# EAGLE schematic Circuit-board-eagle-sheme (EAGLE 6.4)
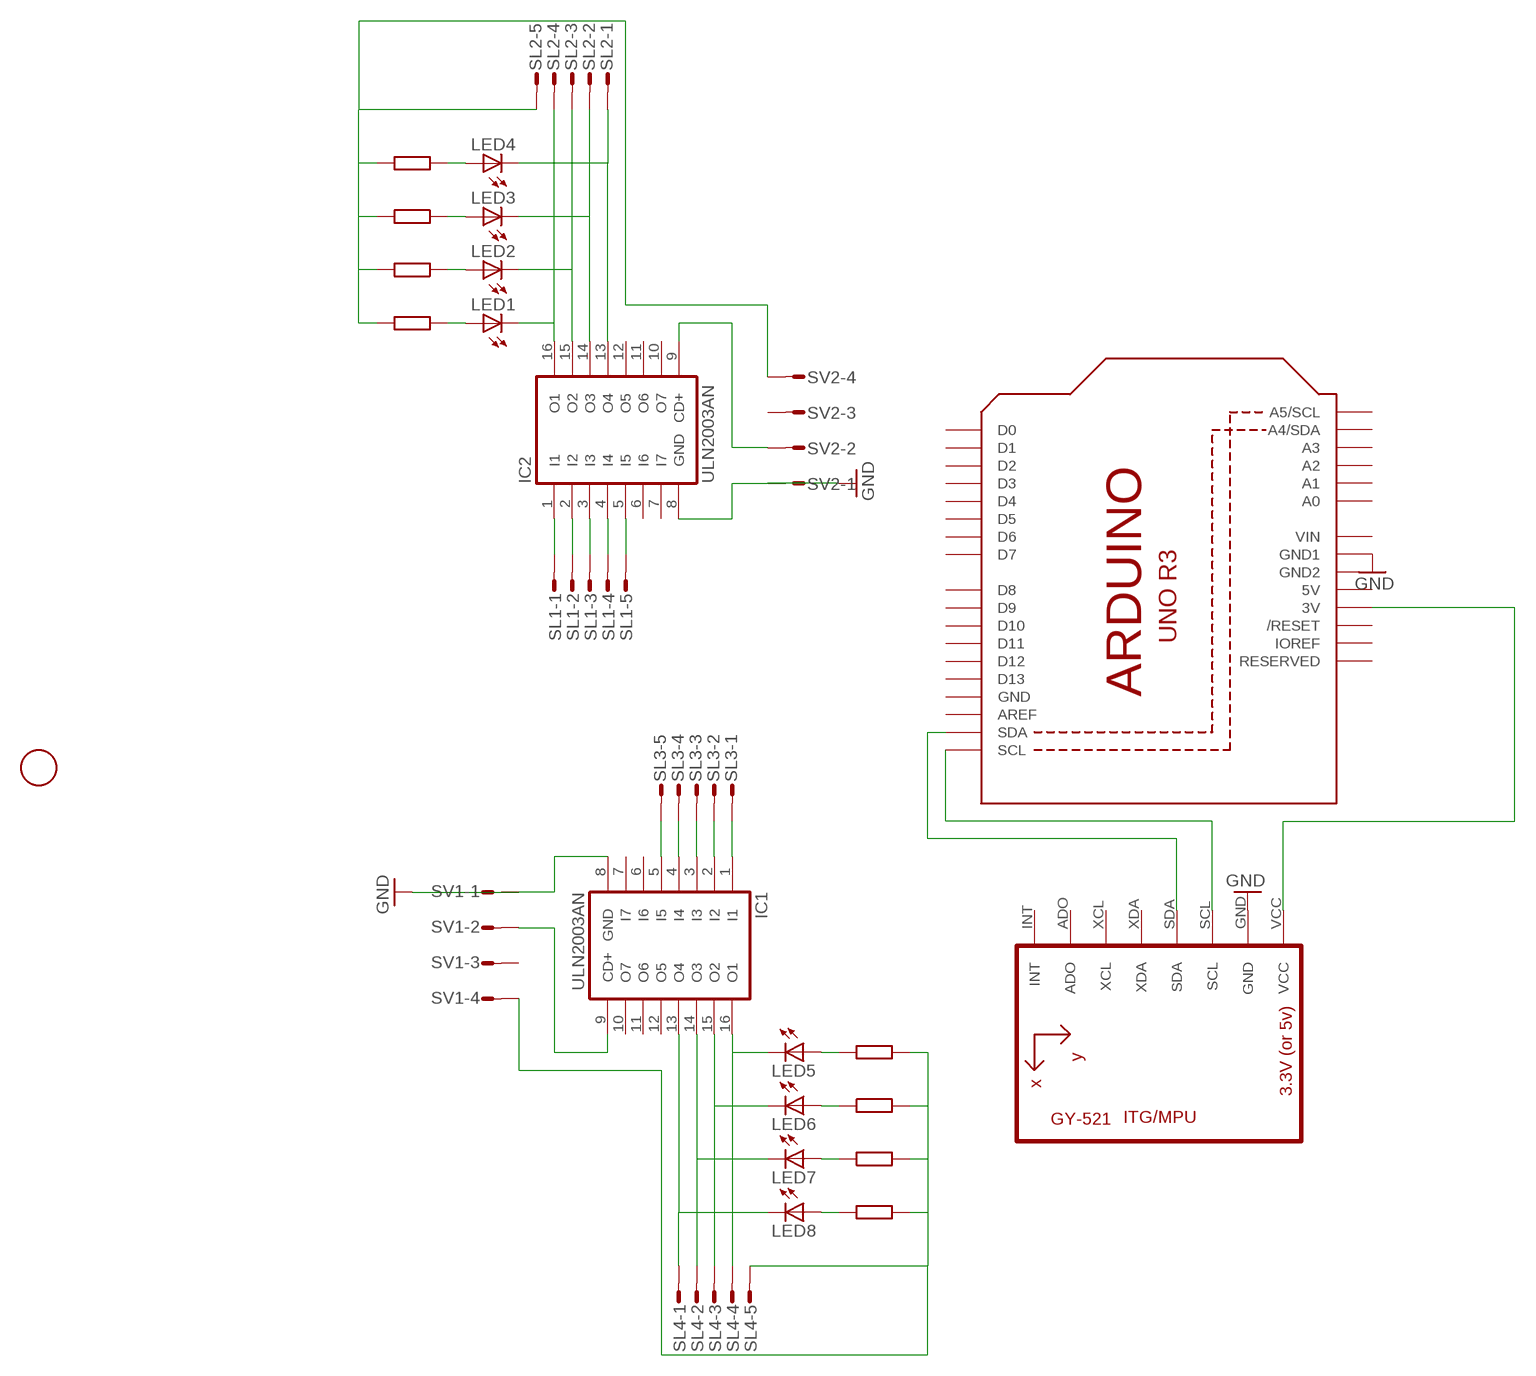
[diagram p0: schematic, sheet 1]

## Parts
IC1  ULN2003AN  [DIL16]
IC2  ULN2003AN  [DIL16]
LED1  LED  [SMARTLED-TTW]
LED2  LED  [SMARTLED-TTW]
LED3  LED  [SMARTLED-TTW]
LED4  LED  [SMARTLED-TTW]
LED5  LED  [SMARTLED-TTW]
LED6  LED  [SMARTLED-TTW]
LED7  LED  [SMARTLED-TTW]
LED8  LED  [SMARTLED-TTW]
SL1  M05S  [05P]
SL2  M05S  [05P]
SL3  M05S  [05P]
SL4  M05S  [05P]
SV1  L04P  [L04P]
SV2  L04P  [L04P]
U1  GY-521MPU6050  [GY-521]
U2  ARDUINOR3-BPLACE  [ARDUINOR3-BPLACE]
U$1  FIDUCIAL  [FIDUCIAL_1MM]

## Nets
GND: IC1.8(GND) IC2.8(GND) SV1.1 SV2.1 U1.GND U2.GND1
N$1: U1.SDA U2.SDA
N$2: U1.SCL U2.SCL
N$3: U1.VCC U2.3V
N$4: IC2.1(I1) SL1.1
N$5: IC2.2(I2) SL1.2
N$6: IC2.3(I3) SL1.3
N$7: IC2.4(I4) SL1.4
N$8: IC2.5(I5) SL1.5
N$9: IC1.1(I1) SL3.1
N$10: IC2.9(CD+) SV2.2
N$11: SL2.5 SV2.4
N$12: LED1.A@1(A)
N$13: LED2.A@1(A)
N$14: IC2.16(O1) LED1.C@1(C) SL2.4
N$15: LED4.A@1(A)
N$16: LED3.A@1(A)
N$17: IC2.15(O2) LED2.C@1(C) SL2.3
N$18: IC2.14(O3) LED3.C@1(C) SL2.2
N$19: IC2.13(O4) LED4.C@1(C) SL2.1
N$20: IC1.2(I2) SL3.2
N$21: IC1.3(I3) SL3.3
N$22: IC1.4(I4) SL3.4
N$23: IC1.5(I5) SL3.5
N$24: IC1.9(CD+) SV1.2
N$25: SL4.5 SV1.4
N$26: LED5.A@1(A)
N$27: LED6.A@1(A)
N$28: LED8.A@1(A)
N$29: LED7.A@1(A)
N$30: IC1.16(O1) LED5.C@1(C) SL4.4
N$31: IC1.15(O2) LED6.C@1(C) SL4.3
N$32: IC1.14(O3) LED7.C@1(C) SL4.2
N$33: IC1.13(O4) LED8.C@1(C) SL4.1
Unconnected: IC1.6(I6) IC1.7(I7) IC1.10(O7) IC1.11(O6) IC1.12(O5) IC2.6(I6) IC2.7(I7) IC2.10(O7) IC2.11(O6) IC2.12(O5) SV1.3 SV2.3 U1.ADO U1.INT U1.XCL U1.XDA U2.A0 U2.A1 U2.A2 U2.A3 U2.A4(A4/SDA) U2.A5(A5/SCL) U2.AREF U2.D0 U2.D1 U2.D2 U2.D3 U2.D4 U2.D5 U2.D6 U2.D7 U2.D8 U2.D9 U2.D10 U2.D11 U2.D12 U2.D13 U2.IOREF U2.RESERVED U2.RESET(/RESET)

## Power pins joined to a net without a drawn wire
5V: U2.5V
GND: U2.GND
GND2: U2.GND2
VIN: U2.VIN

## Library data of the parts
IC1 IC2 = uln-udn:ULN2003A: DRIVER ARRAY
LED1-LED8 = adafruit:LED: LED OSRAM: - CHIPLED LG R971, LG N971, LY N971, LG Q971, LY Q971, LO R971, LY R971 LH N974, LH R974 LS Q976, LO Q976, LY Q976 LO Q996 - Hyper CHIPLED LW Q18S LB Q993, LB Q99A, LB R99A - SideLED LS A670, LO A670, LY A670, LG A670, LP A670 LB A673, LV A673, LT A673, LW A673 LH A674 LY A675 LS A676, LA A676, LO A676, LY A676, LW A676 LS A679, LY A679, LG A679 - Hyper Micro SIDELED® LS Y876, LA Y876, LO Y876, LY Y876 LT Y87S - SmartLED LW L88C, LW L88S LB L89C, LB L89S, LG L890 LS L89K, LO L89K, LY L89K LS L896, LA L896, LO L896, LY L896 - TOPLED LS T670, LO T670, LY T670, LG T670, LP T670 LSG T670, LSP T670, LSY T670, LOP T670, LYG T670 LG T671, LOG T671, LSG T671 LB T673, LV T673, LT T673, LW T673 LH T674 LS T676, LA T676, LO T676, LY T676, LB T676, LH T676, LSB T676, LW T676 LB T67C, LV T67C, LT T67C, LS T67K, LO T67K, LY T67K, LW E67C LS E67B, LA E67B, LO E67B, LY E67B, LB E67C, LV E67C, LT E67C LW T67C LS T679, LY T679, LG T679 LS T770, LO T770, LY T770, LG T770, LP T770 LB T773, LV T773, LT T773, LW T773 LH T774 LS E675, LA E675, LY E675, LS T675 LS T776, LA T776, LO T776, LY T776, LB T776 LHGB T686 LT T68C, LB T68C - Hyper Mini TOPLED® LB M676 - Mini TOPLED Santana® LG M470 LS M47K, LO M47K, LY M47K Source: http://www.osram.convergy.de/
SL1-SL4 = con-amp-quick:M05S: AMP QUICK CONNECTOR; OC_FARNELL: unknown; OC_NEWARK: unknown
SV1 SV2 = con-amp-mt:L04P: AMP MT CONNECTOR; OC_FARNELL: unknown; OC_NEWARK: unknown
U1 = gy-521:GY-521
U2 = adafruit:ARDUINOR3: This is a new object for the new Arduino R3 - with extra pins that you may want to use (such as IOref, and duplicated A4/A5
U$1 = adafruit:FIDUCIAL: For use by pick and place machines to calibrate the vision/machine, 1mm By microbuilder.eu